# Altium project DD2088PoE_Daisy_Chain.PrjPcb (part 5 of 8)

## Sheet DD2088PoE_Daisy_Chain_IMU.SchDoc: =project_title
size Tabloid; CompanyName: Luxonis Holding; DrawnBy: D Dunga; Organization: Luxonis Holding; Address1: 1925 Harmony Park Drive; Address2: Westminster, CO; Address3: 80234; Address4: United States; SheetNumber: 13; SheetTotal: 15
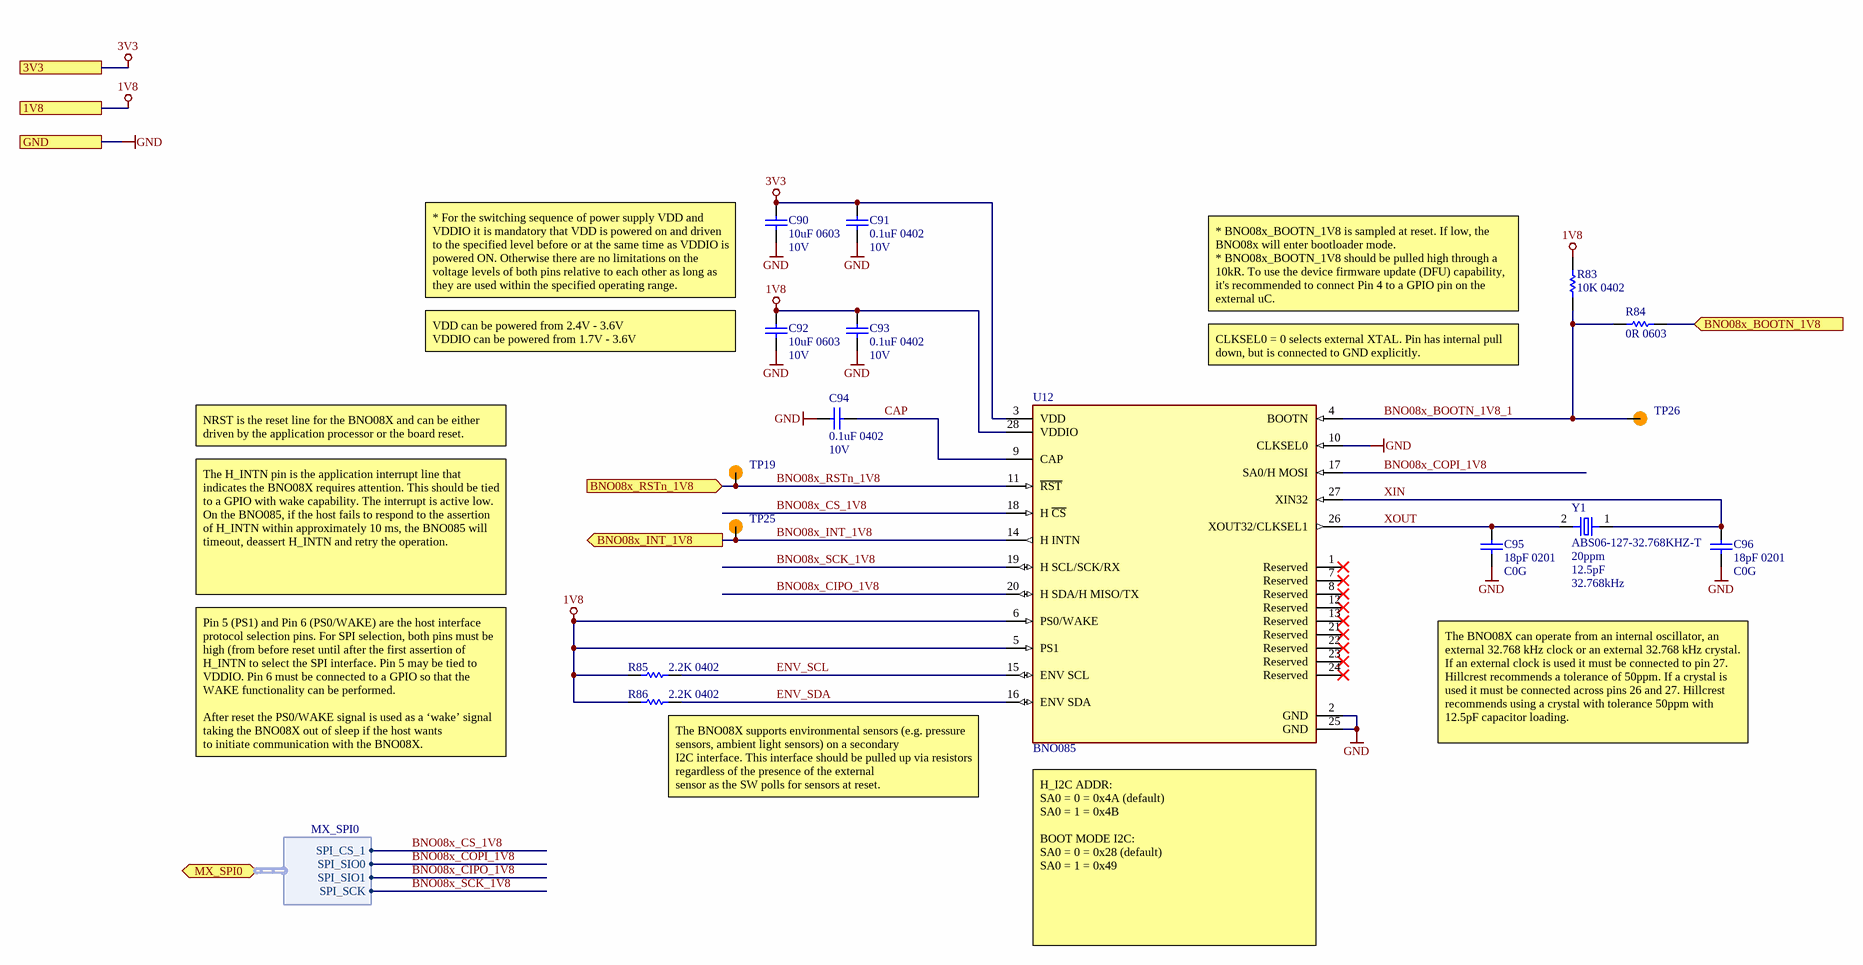
[diagram p9: DD2088PoE_Daisy_Chain_IMU.SchDoc]

### Parts
C90  10uF 0603  Voltage Rating: 10V  [CAPC0603(1608)100_L]
C91  0.1uF 0402  Voltage Rating: 10V  [CAPC0402(1005)70_L]
C92  10uF 0603  Voltage Rating: 10V  [CAPC0603(1608)100_L]
C93  0.1uF 0402  Voltage Rating: 10V  [CAPC0402(1005)70_L]
C94  0.1uF 0402  Voltage Rating: 10V  [CAPC0402(1005)70_L]
C95  18pF 0201  Dielectric: C0G  [CAPC0201(0603)33_L]
C96  18pF 0201  Dielectric: C0G  [CAPC0201(0603)33_L]
R83  10K 0402  [RESC0402(1005)_L]
R84  0R 0603  [RESC0603(1608)_L]
R85  2.2K 0402  [RESC0402(1005)_L]
R86  2.2K 0402  [RESC0402(1005)_L]
TP19  TP100_200_NS  [TP100_200_NS]  (value not drawn)  (no BOM)
TP25  TP100_200_NS  [TP100_200_NS]  (value not drawn)  (no BOM)
TP26  TP100_200_NS  [TP100_200_NS]  (value not drawn)  (no BOM)
U12  BNO085  [BNO085]
Y1  ABS06-127-32.768KHZ-T  Frequency Tolerance: 20ppm  Load Capacitance: 12.5pF  Frequency: 32.768kHz  [ABS06-127-32.768KHZ-T]

### Ports
1V8, 3V3, BNO08x_BOOTN_1V8 (in), BNO08x_INT_1V8 (out), BNO08x_RSTn_1V8 (in), GND, MX_SPI0 (bidir, harness MX_SPI0)

### Harnesses
MX_SPI0: SPI_SIO0, SPI_SIO1, SPI_CS_1, SPI_SCK

### Nets
1V8: C92.2 C93.2 R83.2 R85.1 R86.1 U12.5(PS1) U12.6(PS0/WAKE) U12.28(VDDIO) ; port 1V8
3V3: C90.2 C91.2 U12.3(VDD) ; port 3V3
GND: C90.1 C91.1 C92.1 C93.1 C94.2 C95.1 C96.1 U12.2(GND) U12.10(CLKSEL0) U12.25(GND) ; port GND
BNO08x_BOOTN_1V8: R84.2 ; port BNO08x_BOOTN_1V8
BNO08x_BOOTN_1V8_1: R83.1 R84.1 TP26.1 U12.4(BOOTN)
BNO08x_CIPO_1V8: U12.20(H_SDA/H_MISO/TX) ; port MX_SPI0.SPI_SIO1
BNO08x_COPI_1V8: U12.17(SA0/H_MOSI) ; port MX_SPI0.SPI_SIO0
BNO08x_CS_1V8: U12.18(H_~{CS}) ; port MX_SPI0.SPI_CS_1
BNO08x_INT_1V8: TP25.1 U12.14(H_INTN) ; port BNO08x_INT_1V8
BNO08x_RSTn_1V8: TP19.1 U12.11(~{RST}) ; port BNO08x_RSTn_1V8
BNO08x_SCK_1V8: U12.19(H_SCL/SCK/RX) ; port MX_SPI0.SPI_SCK
CAP: C94.1 U12.9(CAP)
ENV_SCL: R85.2 U12.15(ENV_SCL)
ENV_SDA: R86.2 U12.16(ENV_SDA)
XIN: C96.2 U12.27(XIN32) Y1.1
XOUT: C95.2 U12.26(XOUT32/CLKSEL1) Y1.2

Not connected (* = marked no-connect by the designer): U12 1(Reserved)* 7(Reserved)* 8(Reserved)* 12(Reserved)* 13(Reserved)* 21(Reserved)* 22(Reserved)* 23(Reserved)* 24(Reserved)*

### Notes on the sheet
- * For the switching sequence of power supply VDD and VDDIO it is mandatory that VDD is powered on and driven to the specified level before or at the same time as VDDIO is powered ON. Otherwise there are no limitations on the voltage levels of both pins relative to each other as long as they are used within the specified operating range.
- (near C92) VDD can be powered from 2.4V - 3.6V
  VDDIO can be powered from 1.7V - 3.6V
- * BNO08x_BOOTN_1V8 is sampled at reset. If low, the BNO08x will enter bootloader mode.
  * BNO08x_BOOTN_1V8 should be pulled high through a 10kR. To use the device firmware update (DFU) capability, it's recommended to connect Pin 4 to a GPIO pin on the external uC.
- CLKSEL0 = 0 selects external XTAL. Pin has internal pull down, but is connected to GND explicitly.
- NRST is the reset line for the BNO08X and can be either driven by the application processor or the board reset.
- The H_INTN pin is the application interrupt line that indicates the BNO08X requires attention. This should be tied to a GPIO with wake capability. The interrupt is active low. On the BNO085, if the host fails to respond to the assertion of H_INTN within approximately 10 ms, the BNO085 will timeout, deassert H_INTN and retry the operation.
- Pin 5 (PS1) and Pin 6 (PS0/WAKE) are the host interface protocol selection pins. For SPI selection, both pins must be high (from before reset until after the first assertion of H_INTN to select the SPI interface. Pin 5 may be tied to VDDIO. Pin 6 must be connected to a GPIO so that the WAKE functionality can be performed.
  After reset the PS0/WAKE signal is used as a ‘wake’ signal taking the BNO08X out of sleep if the host wants
  to initiate communication with the BNO08X.
- The BNO08X can operate from an internal oscillator, an external 32.768 kHz clock or an external 32.768 kHz crystal. If an external clock is used it must be connected to pin 27. Hillcrest recommends a tolerance of 50ppm. If a crystal is used it must be connected across pins 26 and 27. Hillcrest recommends using a crystal with tolerance 50ppm with 12.5pF capacitor loading.
- (near R86) The BNO08X supports environmental sensors (e.g. pressure sensors, ambient light sensors) on a secondary
  I2C interface. This interface should be pulled up via resistors regardless of the presence of the external
  sensor as the SW polls for sensors at reset.
- (near U12) H_I2C ADDR:
  SA0 = 0 = 0x4A (default)
  SA0 = 1 = 0x4B
  BOOT MODE I2C:
  SA0 = 0 = 0x28 (default)
  SA0 = 1 = 0x49
- Title
- Size:
- Date:
- Tabloid
- Number:
- Time:
- Revision:
- Sheet
- of
- Drawn by:

### Library data of the parts
C90 C92 = GRM188R61A106ME69D: CAP CER 10UF 10V X5R 0603 20%; Manufacturer 1: Murata; Material: Ceramic; Supplier 1: Digi-Key; Manufacturer Part Number 1: GRM188R61A106ME69D; Stock 1: 2873098; Pricing 1: 1=0.21000, 10=0.14100, 100=0.07130, 500=0.04876, 1000=0.04313 (USD); RoHS: Yes; Mount: Surface Mount; Case/Package: 0603; Weight: 0.000222oz; Case Code (Metric): 1608; Case Code (Imperial): 0603; Min Operating Temperature: -55°C; Max Operating Temperature: 85°C; Packaging: Tape and Reel; Tolerance: 20%; Capacitance: 10uF; Dielectric: X5R; Voltage Rating (DC): 10V; Package Quantity: 4000; Termination: SMD/SMT; Length: 1.6mm; Height: 0.8mm; Width: 0.8mm; Thickness: 0.035inch; Depth: 0.8mm; REACH SVHC: Unknown; Lead Free: Lead Free; ComponentLink1URL: http://www.mouser.com/ds/2/281/c02e-2905.pdf?src-supplier=Mouser; ComponentLink1Description: http://www.mouser.com/ds/2/281/c02e-2905.pdf?src-supplier=Mouser; ComponentLink2URL: http://components.arrow.com/part/dataview/0323_06119472?src-supplier=Arrow+Europe; ComponentLink2Description: http://components.arrow.com/part/dataview/0323_06119472?src-supplier=Arrow+Europe; ComponentLink3URL: http://www.farnell.com/datasheets/2048014.pdf?src-supplier=Farnell; ComponentLink3Description: http://www.farnell.com/datasheets/2048014.pdf?src-supplier=Farnell; ComponentLink4URL: http://www.farnell.com/datasheets/1872210.pdf?src-supplier=Farnell; ComponentLink4Description: http://www.farnell.com/datasheets/1872210.pdf?src-supplier=Farnell; ComponentLink5URL: http://search.murata.co.jp/Ceramy/image/img/A01X/G101/ENG/GRM188R61A106ME69-01.pdf?src-supplier=Digi-Key; ComponentLink5Description: http://search.murata.co.jp/Ceramy/image/img/A01X/G101/ENG/GRM188R61A106ME69-01.pdf?src-supplier=Digi-Key; ComponentLink6URL: http://www.farnell.com/datasheets/1872210.pdf?src-supplier=Newark; ComponentLink6Description: http://www.farnell.com/datasheets/1872210.pdf?src-supplier=Newark; ComponentLink7URL: http://www.farnell.com/datasheets/2048014.pdf?src-supplier=Element14; ComponentLink7Description: http://www.farnell.com/datasheets/2048014.pdf?src-supplier=Element14; ComponentLink8URL: http://www.farnell.com/datasheets/2048014.pdf?src-supplier=Newark; ComponentLink8Description: http://www.farnell.com/datasheets/2048014.pdf?src-supplier=Newark; Supplier Part Number 1: 490-10475-1-ND
C91 C93 C94 = GRM155R71A104JA01D: CAP CER 0.1UF 10V X7R 0402 5%; Manufacturer 1: Murata; Capacitance: 100nF; Supplier 1: Digi-Key; Manufacturer Part Number 1: GRM155R71A104JA01D; Stock 1: 1346709; Pricing 1: 1=0.10000, 10=0.02500, 100=0.01130, 500=0.00806, 1000=0.00633, 2500=0.00575, 5000=0.00529 (USD); RoHS: Yes; Mount: Surface Mount; Case/Package: 0402; Case Code (Imperial): 0402; Case Code (Metric): 1005; Min Operating Temperature: -55°C; Max Operating Temperature: 125°C; Tolerance: 5%; Packaging: Tape and Reel; Voltage Rating (DC): 10V; Dielectric: X7R; Package Quantity: 10000; Termination: SMD/SMT; Length: 1mm; Height: 0.5mm; Width: 0.02inch; Thickness: 0.022inch; Depth: 0.5mm; Radiation Hardening: No; Lead Free: Lead Free; ComponentLink1URL: https://datasheet.ciiva.com/5411/product-5411135.pdf?src-supplier=Mouser; ComponentLink1Description: https://datasheet.ciiva.com/5411/product-5411135.pdf?src-supplier=Mouser; ComponentLink2URL: https://datasheet.ciiva.com/11618/c02e-11618821.pdf?src-supplier=Avnet; ComponentLink2Description: https://datasheet.ciiva.com/11618/c02e-11618821.pdf?src-supplier=Avnet; Supplier Part Number 1: 490-10777-1-ND
C95 C96 = GRM0335C1E180FA01D: Cap Ceramic 18pF 25V C0G 1% Pad SMD 0201 125C T/R; Manufacturer 1: Murata; Supplier 1: Digi-Key; Manufacturer Part Number 1: GRM0335C1E180FA01D; RoHS: Yes; Category: Ceramic Capacitors; Stock 1: 27511; Pricing 1: 1=0.10000, 10=0.02100, 100=0.00930, 500=0.00666, 1000=0.00523, 2500=0.00476, 5000=0.00438 (USD); Mount: Surface Mount; Case/Package: 0201; Case Code (Imperial): 0201; Case Code (Metric): 0603; Min Operating Temperature: -55°C; Max Operating Temperature: 125°C; Capacitance: 18pF; Tolerance: 1%; Packaging: Tape and Reel; Voltage Rating (DC): 25V; Package Quantity: 15000; Voltage Rating: 25V; Termination: SMD/SMT; Length: 0.024inch; Height: 0.3mm; Thickness: 0.013inch; Width: 0.3mm; ComponentLink1URL: https://datasheet.ciiva.com/29538/partnumbering-e-01-29538328.pdf?src-supplier=Digi-Key; ComponentLink1Description: https://datasheet.ciiva.com/29538/partnumbering-e-01-29538328.pdf?src-supplier=Digi-Key; Supplier 2: Digi-Key; Supplier 3: Mouser; Supplier Part Number 3: 81-GRM0335C1E180FA1D; Supplier Part Number 2: 490-17804-2-ND; Supplier Part Number 1: 490-17804-1-ND
R83 = RC0402FR-1310KL: RES SMD 10K OHM 1% 0402 1/16W Chip Resistor, 0402 [1005 Metric], 10 kohm, RC Series, 50 V, Thick Film, 62.5 mW; Manufacturer 1: Yageo; Resistance: 10kR; Temperature Coefficient: 100ppm/°C; Power Rating: 62.5mW; Voltage Rating: 50V; ComponentLink1URL: https://datasheet.ciiva.com/16940/pyu-rc0402-51-rohs-l-6-16940293.pdf?src-supplier=Avnet+Europe; ComponentLink1Description: https://datasheet.ciiva.com/16940/pyu-rc0402-51-rohs-l-6-16940293.pdf?src-supplier=Avnet+Europe; ComponentLink2URL: https://datasheet.ciiva.com/28386/pyu-rc0402-51-rohs-l-6-28386855.pdf?src-supplier=Avnet+Europe; ComponentLink2Description: https://datasheet.ciiva.com/28386/pyu-rc0402-51-rohs-l-6-28386855.pdf?src-supplier=Avnet+Europe; ComponentLink3URL: https://datasheet.ciiva.com/16740/pyu-rc0402-51-rohs-l-6-r-16740602.pdf?src-supplier=Future+Electronics; ComponentLink3Description: https://datasheet.ciiva.com/16740/pyu-rc0402-51-rohs-l-6-r-16740602.pdf?src-supplier=Future+Electronics; ComponentLink4URL: https://datasheet.ciiva.com/8891/pyu-rc0402-51-rohs-l-6-8891339.pdf?src-supplier=Avnet; ComponentLink4Description: https://datasheet.ciiva.com/8891/pyu-rc0402-51-rohs-l-6-8891339.pdf?src-supplier=Avnet; ComponentLink5URL: https://datasheet.ciiva.com/5557/pyu-rc0402-51-rohs-l-6-r-5557997.pdf?src-supplier=Mouser; ComponentLink5Description: https://datasheet.ciiva.com/5557/pyu-rc0402-51-rohs-l-6-r-5557997.pdf?src-supplier=Mouser; ComponentLink6URL: https://datasheet.ciiva.com/7983/1018594-7983533.pdf?src-supplier=Element14; ComponentLink6Description: https://datasheet.ciiva.com/7983/1018594-7983533.pdf?src-supplier=Element14; Supplier 1: Newark; Manufacturer Part Number 1: RC0402FR-1310KL; Stock 1: 62239; Pricing 1: 1=0.10000, 25=0.01200, 100=0.00400, 250=0.00400, 500=0.00300, 1000=0.00300 (USD); RoHS: Yes; Case/Package: 0402; Number of Pins: 2; Contact Plating: Tin,Matte,Lead; Case Code (Imperial): 0402; Case Code (Metric): 1005; Min Operating Temperature: -55°C; Max Operating Temperature: 155°C; Tolerance: 1%; Composition: Thick Film; Packaging: Tape and Reel; Termination: SMD/SMT; Military Standard: Not; Voltage Rating (DC): 50V; Working Voltage: 50V; Number of Terminations: 2; Length: 1mm; Depth: 0.5mm; Radiation Hardening: No; REACH SVHC: No SVHC; Lead Free: Lead Free; Supplier Part Number 1: 67R9960; Supplier 2: Future Electronics; Supplier 3: Mouser; Supplier 4: Element14; Supplier Part Number 2: RC0402FR-1310KL-CUTT; Supplier Part Number 3: 603-RC0402FR-1310KL; Supplier Part Number 4: 1799235
R84 = CRCW06030000Z0EA: RES SMD 0 OHM JUMPER 1/10W 0603 0 Ohms Jumper 0.1W, 1/10W Chip Resistor 0603 (1608 Metric) Automotive AEC-Q200 Thick Film; Manufacturer 1: Vishay; Manufacturer Part Number 1: CRCW0603-0000Z0EA; Resistance: 0mR; Power Rating: 100mW; Voltage Rating: 75V; Temperature Coefficient: 100ppm/°C; Tolerance: 5%; Current Rating: 2A; Supplier 1: Digi-Key; Stock 1: 742743; Pricing 1: 1=0.100000, 10=0.034000, 25=0.024400, 50=0.018600, 100=0.013800, 250=0.010480, 500=0.008400, 1000=0.006180 (USD); RoHS: Yes; Mount: Surface Mount; Case/Package: 0603; Weight: 7.1E-05oz; Contact Plating: Tin,Lead; Case Code (Metric): 1608; Case Code (Imperial): 0603; Min Operating Temperature: -55°C; Max Operating Temperature: 155°C; Composition: Thick Film; Termination: SMD/SMT; Packaging: Tape and Reel; Package Quantity: 1; Number of Terminations: 2; Military Standard: Not; Max Power Dissipation: 100mW; Voltage Rating (DC): 75V; Features: Automotive AEC-Q200; Working Voltage: 75V; Length: 1.55mm; Height: 0.02inch; Width: 0.033inch; Depth: 0.85mm; Radiation Hardening: No; Lead Free: Lead Free; REACH SVHC: Unknown; ComponentLink1URL: https://datasheet.ciiva.com/2461/dcrcwe3-2461968.pdf?src-supplier=Digi-Key; ComponentLink1Description: https://datasheet.ciiva.com/2461/dcrcwe3-2461968.pdf?src-supplier=Digi-Key; ComponentLink2URL: https://datasheet.ciiva.com/2461/dcrcwe3-2461969.pdf?src-supplier=Digi-Key; ComponentLink2Description: https://datasheet.ciiva.com/2461/dcrcwe3-2461969.pdf?src-supplier=Digi-Key; ComponentLink3URL: https://datasheet.ciiva.com/2461/dcrcwe3-2461970.pdf?src-supplier=Digi-Key; ComponentLink3Description: https://datasheet.ciiva.com/2461/dcrcwe3-2461970.pdf?src-supplier=Digi-Key; ComponentLink4URL: https://datasheet.ciiva.com/8340/dcrcwe3-8340197.pdf?src-supplier=Avnet; ComponentLink4Description: https://datasheet.ciiva.com/8340/dcrcwe3-8340197.pdf?src-supplier=Avnet; ComponentLink5URL: https://datasheet.ciiva.com/16941/dcrcw-16941302.pdf?src-supplier=Avnet+Europe; ComponentLink5Description: https://datasheet.ciiva.com/16941/dcrcw-16941302.pdf?src-supplier=Avnet+Europe; ComponentLink6URL: https://datasheet.ciiva.com/16199/dcrcwe3-16199063.pdf?src-supplier=Future+Electronics; ComponentLink6Description: https://datasheet.ciiva.com/16199/dcrcwe3-16199063.pdf?src-supplier=Future+Electronics; ComponentLink7URL: https://datasheet.ciiva.com/16725/70201119-16725175.pdf?src-supplier=Allied+Electronics; ComponentLink7Description: https://datasheet.ciiva.com/16725/70201119-16725175.pdf?src-supplier=Allied+Electronics; ComponentLink8URL: https://datasheet.ciiva.com/26316/fld-crcw-e3-data-en-26316615.pdf?src-supplier=Distrelec; ComponentLink8Description: https://datasheet.ciiva.com/26316/fld-crcw-e3-data-en-26316615.pdf?src-supplier=Distrelec; ComponentLink9URL: https://datasheet.ciiva.com/5544/dcrcwe3-109170-5544344.pdf?src-supplier=Mouser; ComponentLink9Description: https://datasheet.ciiva.com/5544/dcrcwe3-109170-5544344.pdf?src-supplier=Mouser; ComponentLink10URL: https://datasheet.ciiva.com/7841/1720486-7841816.pdf?src-supplier=Element14; ComponentLink10Description: https://datasheet.ciiva.com/7841/1720486-7841816.pdf?src-supplier=Element14; ComponentLink11URL: https://datasheet.ciiva.com/7841/1720486-7841817.pdf?src-supplier=Element14; ComponentLink11Description: https://datasheet.ciiva.com/7841/1720486-7841817.pdf?src-supplier=Element14; ComponentLink12URL: https://datasheet.ciiva.com/7841/125364-7841818.pdf?src-supplier=Element14; ComponentLink12Description: https://datasheet.ciiva.com/7841/125364-7841818.pdf?src-supplier=Element14; ComponentLink13URL: https://datasheet.ciiva.com/16721/70201119-16721450.pdf?src-supplier=Allied+Electronics; ComponentLink13Description: https://datasheet.ciiva.com/16721/70201119-16721450.pdf?src-supplier=Allied+Electronics; Supplier Part Number 1: 541-0.0GCT-ND
R85 R86 = RC0402FR-072K2L: RES SMD 2.2K OHM 1% 1/16W 0402; Manufacturer 1: Yageo; Resistance: 2.2kR; Temperature Coefficient: 100ppm/°C; Power Rating: 63mW; Voltage Rating: 50V; Supplier 1: Digi-Key; Manufacturer Part Number 1: RC0402FR-072K2L; Stock 1: 12579098; Pricing 1: 1=0.10000, 10=0.01600, 100=0.00640, 1000=0.00289, 2500=0.00251, 5000=0.00207 (USD); RoHS: Yes; Case/Package: 0402; Weight: 2.3E-05oz; Case Code (Imperial): 0402; Case Code (Metric): 1005; Min Operating Temperature: -55°C; Max Operating Temperature: 155°C; Packaging: Tape and Reel; Tolerance: 1%; Composition: Thick Film; Termination: SMD/SMT; Military Standard: Not; Length: 1mm; Height: 0.35mm; Width: 0.5mm; Depth: 0.5mm; Lead Free: Lead Free; REACH SVHC: Unknown; ComponentLink1URL: https://datasheet.ciiva.com/11808/0900766b80c66297-11808786.pdf?src-supplier=RSComponents; ComponentLink1Description: https://datasheet.ciiva.com/11808/0900766b80c66297-11808786.pdf?src-supplier=RSComponents; ComponentLink2URL: https://datasheet.ciiva.com/12577/pyu-rc0402-51-rohs-l-6-r-12577429.pdf?src-supplier=Mouser; ComponentLink2Description: https://datasheet.ciiva.com/12577/pyu-rc0402-51-rohs-l-6-r-12577429.pdf?src-supplier=Mouser; ComponentLink3URL: https://datasheet.ciiva.com/16741/pyu-rc0402-51-rohs-l-6-r-16741015.pdf?src-supplier=Future+Electronics; ComponentLink3Description: https://datasheet.ciiva.com/16741/pyu-rc0402-51-rohs-l-6-r-16741015.pdf?src-supplier=Future+Electronics; ComponentLink4URL: https://datasheet.ciiva.com/7983/1018594-7983515.pdf?src-supplier=Element14; ComponentLink4Description: https://datasheet.ciiva.com/7983/1018594-7983515.pdf?src-supplier=Element14; ComponentLink5URL: https://datasheet.ciiva.com/46383/1018594-46383563.pdf?src-supplier=Element14; ComponentLink5Description: https://datasheet.ciiva.com/46383/1018594-46383563.pdf?src-supplier=Element14; ComponentLink6URL: https://datasheet.ciiva.com/7849/1018594-7849928.pdf?src-supplier=Element14; ComponentLink6Description: https://datasheet.ciiva.com/7849/1018594-7849928.pdf?src-supplier=Element14; ComponentLink7URL: https://datasheet.ciiva.com/7849/1018594-7849929.pdf?src-supplier=Element14; ComponentLink7Description: https://datasheet.ciiva.com/7849/1018594-7849929.pdf?src-supplier=Element14; Supplier 2: Mouser; Supplier 3: Newark; Supplier Part Number 1: 311-2.20KLRCT-ND; Supplier Part Number 2: 603-RC0402FR-072K2L; Supplier Part Number 3: 98K7523
TP19 TP25 TP26 = TEST_POINT
U12 = BNO085: IMU ACCEL/GYRO/MAG I2C 32BIT; Manufacturer 1: Hillcrest Laboratories; Sensor Type: Accelerometer,Gyroscope,Magnetometer; Output Type: SPI,I2C; Supplier 1: Digi-Key; Manufacturer Part Number 1: BNO085; RoHS: No; Category: Inertial Measurement Units (IMUs); Stock 1: 11593; Pricing 1: 1=11.85000, 5=10.31200, 10=9.28100, 25=8.25000, 50=7.63120, 100=6.60000, 500=6.18750, 1000=5.77500 (USD); Mount: Surface Mount; Case/Package: LGA; Min Operating Temperature: -40°C; Max Operating Temperature: 85°C; Packaging: Tape and Reel; ComponentLink1URL: https://www.hillcrestlabs.com/downloads/bno080-datasheet?src-supplier=Digi-Key; ComponentLink1Description: https://www.hillcrestlabs.com/downloads/bno080-datasheet?src-supplier=Digi-Key; ComponentLink2URL: https://www.hillcrestlabs.com/downloads/bno080-migration-guide?src-supplier=Digi-Key; ComponentLink2Description: https://www.hillcrestlabs.com/downloads/bno080-migration-guide?src-supplier=Digi-Key; Supplier Part Number 1: 1888-1006-1-ND
Y1 = ABS06-127-32.768KHZ-T: CRYSTAL 32.768kHz ±20ppm Crystal 12.5pF 90 kOhms 2-SMD, No Lead; Manufacturer 1: Abracon; ESR (Equivalent Series Resistance): 90kR; Supplier 1: Digi-Key; Manufacturer Part Number 1: ABS06-127-32.768KHZ-T; RoHS: Yes; Stock 1: 1640; Pricing 1: 1=0.69000, 10=0.60700, 50=0.56760, 100=0.50160, 500=0.47520, 1000=0.39600 (USD); Mount: Surface Mount; Case/Package: SMD/SMT; Min Operating Temperature: -40°C; Max Operating Temperature: 85°C; Packaging: Tape and Reel; ComponentLink1URL: http://www.farnell.com/datasheets/2614114.pdf?src-supplier=Farnell; ComponentLink1Description: http://www.farnell.com/datasheets/2614114.pdf?src-supplier=Farnell; ComponentLink2URL: https://abracon.com/datasheets/ABS06-127-32.768kHz-T.pdf?src-supplier=Digi-Key; ComponentLink2Description: https://abracon.com/datasheets/ABS06-127-32.768kHz-T.pdf?src-supplier=Digi-Key; ComponentLink3URL: http://www.farnell.com/datasheets/2614114.pdf?src-supplier=Newark; ComponentLink3Description: http://www.farnell.com/datasheets/2614114.pdf?src-supplier=Newark; Supplier 2: Digi-Key; Supplier 3: Mouser; Supplier 4: Verical; Supplier Part Number 1: 535-14513-1-ND; Supplier Part Number 2: 535-14513-6-ND; Supplier Part Number 3: 815-ABS0612732.768KT; Supplier Part Number 4: ABS06-127-32.768KHZ-T

## Sheet RJ45_1.SchDoc: =project_title
size Tabloid; CompanyName: Luxonis Holding; DrawnBy: D Dunga; Organization: Luxonis Holding; Address1: 1925 Harmony Park Drive; Address2: Westminster, CO; Address3: 80234; Address4: United States; SheetNumber: 9; SheetTotal: 15
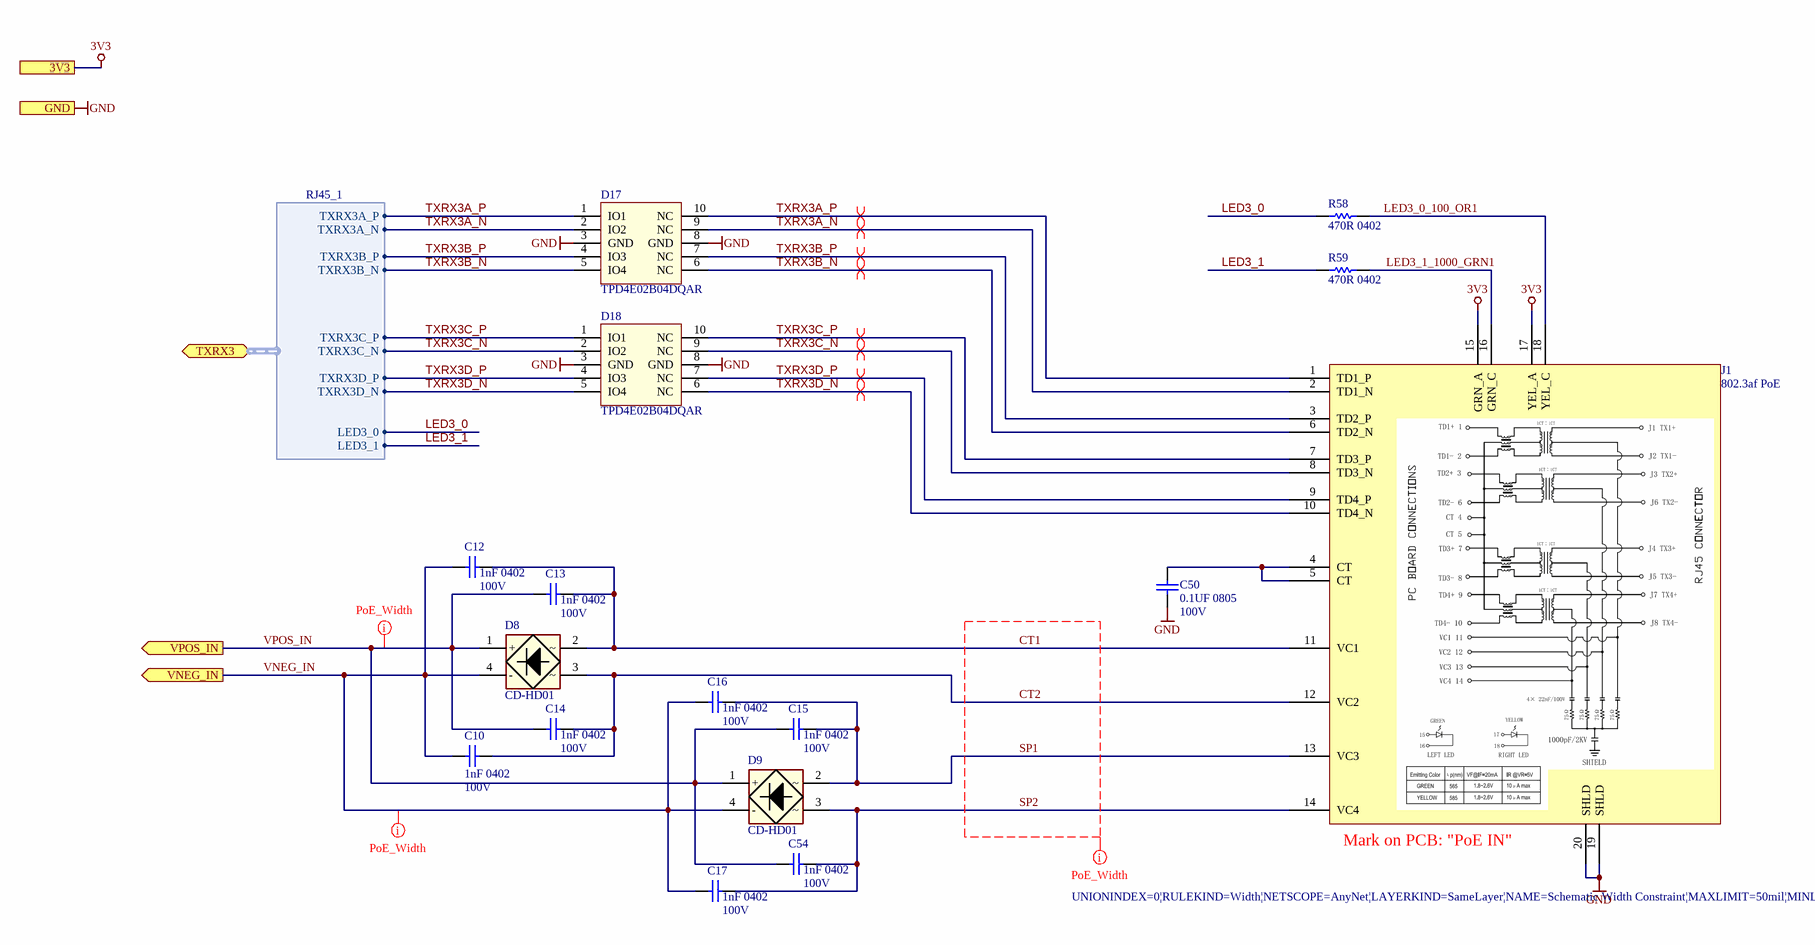
[diagram p10: RJ45_1.SchDoc]

### Parts
C10  1nF 0402  Voltage: 100V  [CAPC0402(1005)60_N]
C12  1nF 0402  Voltage: 100V  [CAPC0402(1005)60_N]
C13  1nF 0402  Voltage: 100V  [CAPC0402(1005)60_N]
C14  1nF 0402  Voltage: 100V  [CAPC0402(1005)60_N]
C15  1nF 0402  Voltage: 100V  [CAPC0402(1005)60_N]
C16  1nF 0402  Voltage: 100V  [CAPC0402(1005)60_N]
C17  1nF 0402  Voltage: 100V  [CAPC0402(1005)60_N]
C50  0.1UF 0805  Voltage Rating: 100V  [CAPC0805(2012)145_N]
C54  1nF 0402  Voltage: 100V  [CAPC0402(1005)60_N]
D8  CD-HD01  [SMD-4]
D9  CD-HD01  [SMD-4]
D17  TPD4E02B04DQAR  [TPD4E02B04DQAR]
D18  TPD4E02B04DQAR  [TPD4E02B04DQAR]
J1  802.3af PoE  [TRJG0926HENL]
R58  470R 0402  [RESC0402(1005)_N]
R59  470R 0402  [RESC0402(1005)_N]

### Ports
3V3, GND, TXRX3 (bidir, harness RJ45_1), VNEG_IN (out), VPOS_IN (out)

### Harnesses
RJ45_1: TXRX3A_P, TXRX3A_N, TXRX3B_P, TXRX3B_N, TXRX3C_P, TXRX3C_N, TXRX3D_P, TXRX3D_N, LED3_0, LED3_1

### Nets
3V3: J1.15(GRN_A) J1.17(YEL_A) ; port 3V3
GND: C50.1 D17.3(GND) D17.8(GND) D18.3(GND) D18.8(GND) J1.19(SHLD) J1.20(SHLD) ; port GND
VNEG_IN: C10.2 C12.2 C16.2 C17.2 D8.4(-) D9.4(-) ; port VNEG_IN
CT1: C12.1 C13.1 D8.2 J1.11(VC1)
CT2: C10.1 C14.1 D8.3 J1.12(VC2)
LED3_0: R58.1 ; port TXRX3.LED3_0
LED3_0_100_OR1: J1.18(YEL_C) R58.2
LED3_1: R59.1 ; port TXRX3.LED3_1
LED3_1_1000_GRN1: J1.16(GRN_C) R59.2
SP1: C15.1 C16.1 D9.2 J1.13(VC3)
SP2: C17.1 C54.1 D9.3 J1.14(VC4)
TXRX3A_N: D17.2(IO2) D17.9(NC) J1.2(TD1_N) ; port TXRX3.TXRX3A_N
TXRX3A_P: D17.1(IO1) D17.10(NC) J1.1(TD1_P) ; port TXRX3.TXRX3A_P
TXRX3B_N: D17.5(IO4) D17.6(NC) J1.6(TD2_N) ; port TXRX3.TXRX3B_N
TXRX3B_P: D17.4(IO3) D17.7(NC) J1.3(TD2_P) ; port TXRX3.TXRX3B_P
TXRX3C_N: D18.2(IO2) D18.9(NC) J1.8(TD3_N) ; port TXRX3.TXRX3C_N
TXRX3C_P: D18.1(IO1) D18.10(NC) J1.7(TD3_P) ; port TXRX3.TXRX3C_P
TXRX3D_N: D18.5(IO4) D18.6(NC) J1.10(TD4_N) ; port TXRX3.TXRX3D_N
TXRX3D_P: D18.4(IO3) D18.7(NC) J1.9(TD4_P) ; port TXRX3.TXRX3D_P
VPOS_IN: C13.2 C14.2 C15.2 C54.2 D8.1(+) D9.1(+) ; port VPOS_IN
NetC50_2: C50.2 J1.4(CT) J1.5(CT)

### Layout directives
rule Width Constraint [Pref Width = 15mil    Min Width = 4mil    Max Width = 50mil]; net class PoE: CT1, CT2, SP1, SP2, VNEG_IN, VPOS_IN
differential pair; net class ETH; differential pair class 100ohm: TXRX3A_N, TXRX3A_P, TXRX3B_N, TXRX3B_P, TXRX3C_N, TXRX3C_P, TXRX3D_N, TXRX3D_P

### Notes on the sheet
- (near J1) Mark on PCB: "PoE IN"
- Title
- Size:
- Date:
- Tabloid
- Number:
- Time:
- Revision:
- Sheet
- of
- Drawn by:

### Library data of the parts
C10 C12-C17 C54 = GRM155R72A102KA01D: CAP CER 1000PF 100V X7R 0402; Manufacturer 1: Murata; Material: Ceramic; Tolerance: 10%; Supplier 1: Digi-Key; Manufacturer Part Number 1: GRM155R72A102KA01D; Stock 1: 634387; Pricing 1: 1=0.10000, 10=0.05700, 100=0.02530, 500=0.01810, 1000=0.01422, 2500=0.01292, 5000=0.01189 (USD); RoHS: Yes; Mount: Surface Mount; Case/Package: 0402; Case Code (Metric): 1005; Case Code (Imperial): 0402; Min Operating Temperature: -55°C; Max Operating Temperature: 125°C; Capacitance: 1nF; Packaging: Tape and Reel; Voltage Rating (DC): 100V; Dielectric: X7R; Package Quantity: 10000; Termination: SMD/SMT; Voltage Rating: 100V; Length: 1mm; Height: 0.5mm; Depth: 0.5mm; Width: 0.5mm; Thickness: 0.022inch; Radiation Hardening: No; REACH SVHC: No SVHC; Lead Free: Lead Free; ComponentLink1URL: https://datasheet.ciiva.com/18184/getdatasheetpartid-223878-18184773.pdf?src-supplier=Verical; ComponentLink1Description: https://datasheet.ciiva.com/18184/getdatasheetpartid-223878-18184773.pdf?src-supplier=Verical; ComponentLink2URL: https://datasheet.ciiva.com/11621/product-11621687.pdf?src-supplier=Avnet; ComponentLink2Description: https://datasheet.ciiva.com/11621/product-11621687.pdf?src-supplier=Avnet; ComponentLink3URL: https://datasheet.ciiva.com/6270/partnumbering-e-01-6270792.pdf?src-supplier=Digi-Key; ComponentLink3Description: https://datasheet.ciiva.com/6270/partnumbering-e-01-6270792.pdf?src-supplier=Digi-Key; ComponentLink4URL: https://datasheet.ciiva.com/6270/partnumbering-e-01-6270796.pdf?src-supplier=Digi-Key; ComponentLink4Description: https://datasheet.ciiva.com/6270/partnumbering-e-01-6270796.pdf?src-supplier=Digi-Key; ComponentLink5URL: https://datasheet.ciiva.com/6270/partnumbering-e-01-6270798.pdf?src-supplier=Digi-Key; ComponentLink5Description: https://datasheet.ciiva.com/6270/partnumbering-e-01-6270798.pdf?src-supplier=Digi-Key; Supplier 2: Mouser; Supplier 3: Arrow; Supplier Part Number 1: 490-6366-1-ND; Supplier Part Number 2: 81-GRM155R72A102KA1D; Supplier Part Number 3: GRM155R72A102KA01D
C50 = CL21B104KCFNNNE: CAP CER 0.1UF 100V X7R 0805; Manufacturer 1: Samsung; Tolerance: 10%; Capacitance: 100nF; Supplier 1: Digi-Key; Manufacturer Part Number 1: CL21B104KCFNNNE; Stock 1: 93036; Pricing 1: 1=0.10000, 10=0.06800, 100=0.03050, 500=0.02180, 1000=0.01712 (USD); RoHS: Yes; Mount: Surface Mount; Case/Package: 0805; Case Code (Metric): 2012; Case Code (Imperial): 0805; Min Operating Temperature: -55°C; Max Operating Temperature: 125°C; Packaging: Tape and Reel; Dielectric: X7R; Length: 2mm; Width: 0.049inch; Thickness: 0.053inch; Depth: 1.25mm; Radiation Hardening: No; ComponentLink1URL: https://datasheet.ciiva.com/26936/getdatasheetpartid-781823-26936904.pdf?src-supplier=Verical; ComponentLink1Description: https://datasheet.ciiva.com/26936/getdatasheetpartid-781823-26936904.pdf?src-supplier=Verical; Supplier 2: Newark; Supplier 3: Future Electronics; Supplier Part Number 3: CL21B104KCFNNNE-CUTT; Supplier Part Number 2: 82AC9430; Supplier Part Number 1: 1276-6840-1-ND
D8 D9 = CD-HD01: CD-HD0x Series Schottky Bridge Rectifier Diode 100V 4-Pin Surface Mount T/R; Manufacturer 1: Bourns; Average Rectified Current: 1A; Mount: Surface Mount; Min Operating Temperature: -55°C; Max Operating Temperature: 125°C; Packaging: Tape and Reel; RoHS Compliant: Yes; ComponentLink1URL: http://www.farnell.com/datasheets/2176057.pdf?src-supplier=Farnell; ComponentLink1Description: http://www.farnell.com/datasheets/2176057.pdf?src-supplier=Farnell; ComponentLink2URL: https://www.bourns.com/docs/Product-Datasheets/cd-hd0x.pdf?src-supplier=Digi-Key; ComponentLink2Description: https://www.bourns.com/docs/Product-Datasheets/cd-hd0x.pdf?src-supplier=Digi-Key; Supplier 1: Digi-Key; Supplier Part Number 1: CD-HD01CT-ND; Manufacturer Part Number 1: CD-HD01; RoHS: Yes; Stock 1: 5000; Pricing 1: 1=0.67000, 10=0.57800, 100=0.43120, 500=0.33880, 1000=0.26180, 2000=0.23870 (USD); Supplier 2: Mouser; Supplier Part Number 2: 652-CD-HD01
D17 D18 = TPD4E02B04DQAR: TVS DIODE 3.6V 8.8V 10USON 8.8V (Typ) Clamp 5A (8/20µs) Ipp Tvs Diode Surface Mount 10-USON (2.5x1); Manufacturer 1: Texas Instruments; Number of Bidirectional Channels: 4; Min Breakdown Voltage: 5.5V; Peak Pulse Power: 17W; Power Line Protection: No; Interface: USB,HDMI; Supplier 1: Digi-Key; Manufacturer Part Number 1: TPD4E02B04DQAR; Stock 1: 25615; Pricing 1: 1=0.69000, 10=0.60800, 100=0.46650, 500=0.36874, 1000=0.29499 (USD); RoHS: Yes; Mount: Surface Mount; Number of Pins: 10; Min Operating Temperature: -40°C; Max Operating Temperature: 125°C; Packaging: Cut Tape; Reverse Standoff Voltage: 3.6V; Clamping Voltage: 8.8V; Operating Supply Voltage: 3.6V; Peak Pulse Current: 5A; Number of Channels: 4; Composition: Zener; REACH SVHC: No SVHC; Lead Free: Lead Free; ComponentLink1URL: http://www.ti.com/general/docs/lit/getliterature.tsp?genericPartNumber=TPD4E02B04&amp;&amp;fileType=pdf&src-supplier=Element14; ComponentLink1Description: http://www.ti.com/general/docs/lit/getliterature.tsp?genericPartNumber=TPD4E02B04&amp;&amp;fileType=pdf&src-supplier=Element14; ComponentLink2URL: http://www.ti.com/lit/ds/symlink/tpd4e02b04.pdf?src-supplier=Farnell; ComponentLink2Description: http://www.ti.com/lit/ds/symlink/tpd4e02b04.pdf?src-supplier=Farnell; ComponentLink3URL: http://www.ti.com/lit/ds/symlink/tpd4e02b04.pdf?src-supplier=Newark; ComponentLink3Description: http://www.ti.com/lit/ds/symlink/tpd4e02b04.pdf?src-supplier=Newark; ComponentLink4URL: http://www.ti.com/lit/ds/symlink/tpd4e02b04.pdf?src-supplier=Digi-Key; ComponentLink4Description: http://www.ti.com/lit/ds/symlink/tpd4e02b04.pdf?src-supplier=Digi-Key; Supplier Part Number 1: 296-43875-1-ND
J1 = TRJG0926HENL: CONN MAGJACK 1PORT 1000 BASET; Manufacturer 1: Trxcom; System: Connector; Manufacturer Part Number 1: TRJG0926HENL; Supplier 1: Trxcom; Supplier Part Number 1: TRJG0926HENL
R58 R59 = CRCW0402470RFKED: RES SMD 470 OHM 1% 1/16W 0402; Manufacturer 1: Vishay; Temperature Coefficient: 100ppm/°C; Power Rating: 63mW; Voltage Rating: 50V; Supplier 1: Digi-Key; Manufacturer Part Number 1: CRCW0402470RFKED; Stock 1: 9199; Pricing 1: 1=0.10000, 10=0.03800, 100=0.01540, 1000=0.00690, 2500=0.00599, 5000=0.00495 (USD); RoHS: Yes; Case/Package: 0402; Weight: 2.3E-05oz; Case Code (Imperial): 0402; Case Code (Metric): 1005; Min Operating Temperature: -55°C; Max Operating Temperature: 155°C; Packaging: Tape and Reel; Resistance: 470R; Tolerance: 1%; Composition: Thick Film; Voltage Rating (DC): 50V; Termination: SMD/SMT; Military Standard: Not; Length: 1mm; Height: 0.35mm; Width: 0.5mm; Depth: 0.5mm; Lead Free: Lead Free; ComponentLink1URL: https://datasheet.ciiva.com/11811/0900766b80d98824-11811416.pdf?src-supplier=RSComponents; ComponentLink1Description: https://datasheet.ciiva.com/11811/0900766b80d98824-11811416.pdf?src-supplier=RSComponents; Supplier 2: Newark; Supplier Part Number 1: 541-470LCT-ND; Supplier Part Number 2: 26W9133; Mount: Surface Mount; Contact Plating: Tin; Number of Terminations: 2; Package Quantity: 10; Max Power Dissipation: 63mW; Features: Automotive AEC-Q200; Radiation Hardening: No; REACH SVHC: Unknown; ComponentLink2URL: https://datasheet.ciiva.com/16764/70201119-16764886.pdf?src-supplier=Allied+Electronics; ComponentLink2Description: https://datasheet.ciiva.com/16764/70201119-16764886.pdf?src-supplier=Allied+Electronics; ComponentLink3URL: https://datasheet.ciiva.com/28613/1720486-28613479.pdf?src-supplier=Element14; ComponentLink3Description: https://datasheet.ciiva.com/28613/1720486-28613479.pdf?src-supplier=Element14; ComponentLink4URL: https://datasheet.ciiva.com/3256/dcrcwe3-3256553.pdf?src-supplier=Avnet; ComponentLink4Description: https://datasheet.ciiva.com/3256/dcrcwe3-3256553.pdf?src-supplier=Avnet; ComponentLink5URL: https://datasheet.ciiva.com/7777/1720486-7777243.pdf?src-supplier=Element14; ComponentLink5Description: https://datasheet.ciiva.com/7777/1720486-7777243.pdf?src-supplier=Element14; ComponentLink6URL: https://datasheet.ciiva.com/8336/dcrcwe3-8336715.pdf?src-supplier=Avnet; ComponentLink6Description: https://datasheet.ciiva.com/8336/dcrcwe3-8336715.pdf?src-supplier=Avnet; ComponentLink7URL: https://datasheet.ciiva.com/7777/1697337-7777244.pdf?src-supplier=Element14; ComponentLink7Description: https://datasheet.ciiva.com/7777/1697337-7777244.pdf?src-supplier=Element14; ComponentLink8URL: https://datasheet.ciiva.com/2463/dcrcwe3-2463085.pdf?src-supplier=Digi-Key; ComponentLink8Description: https://datasheet.ciiva.com/2463/dcrcwe3-2463085.pdf?src-supplier=Digi-Key; ComponentLink9URL: https://datasheet.ciiva.com/16362/dcrcwe3-16362109.pdf?src-supplier=Future+Electronics; ComponentLink9Description: https://datasheet.ciiva.com/16362/dcrcwe3-16362109.pdf?src-supplier=Future+Electronics; ComponentLink10URL: https://datasheet.ciiva.com/16882/dcrcwe3-16882493.pdf?src-supplier=Avnet+Europe; ComponentLink10Description: https://datasheet.ciiva.com/16882/dcrcwe3-16882493.pdf?src-supplier=Avnet+Europe; ComponentLink11URL: https://datasheet.ciiva.com/2463/dcrcwe3-2463086.pdf?src-supplier=Digi-Key; ComponentLink11Description: https://datasheet.ciiva.com/2463/dcrcwe3-2463086.pdf?src-supplier=Digi-Key; ComponentLink12URL: https://datasheet.ciiva.com/2463/dcrcwe3-2463087.pdf?src-supplier=Digi-Key; ComponentLink12Description: https://datasheet.ciiva.com/2463/dcrcwe3-2463087.pdf?src-supplier=Digi-Key

## Sheet RJ45_2.SchDoc: =project_title
size Tabloid; CompanyName: Luxonis Holding; DrawnBy: Dan Dunga; Organization: Luxonis Holding; Address1: 1925 Harmony Park Drive; Address2: Westminster, CO; Address3: 80234; Address4: United States; SheetNumber: 10; SheetTotal: 15
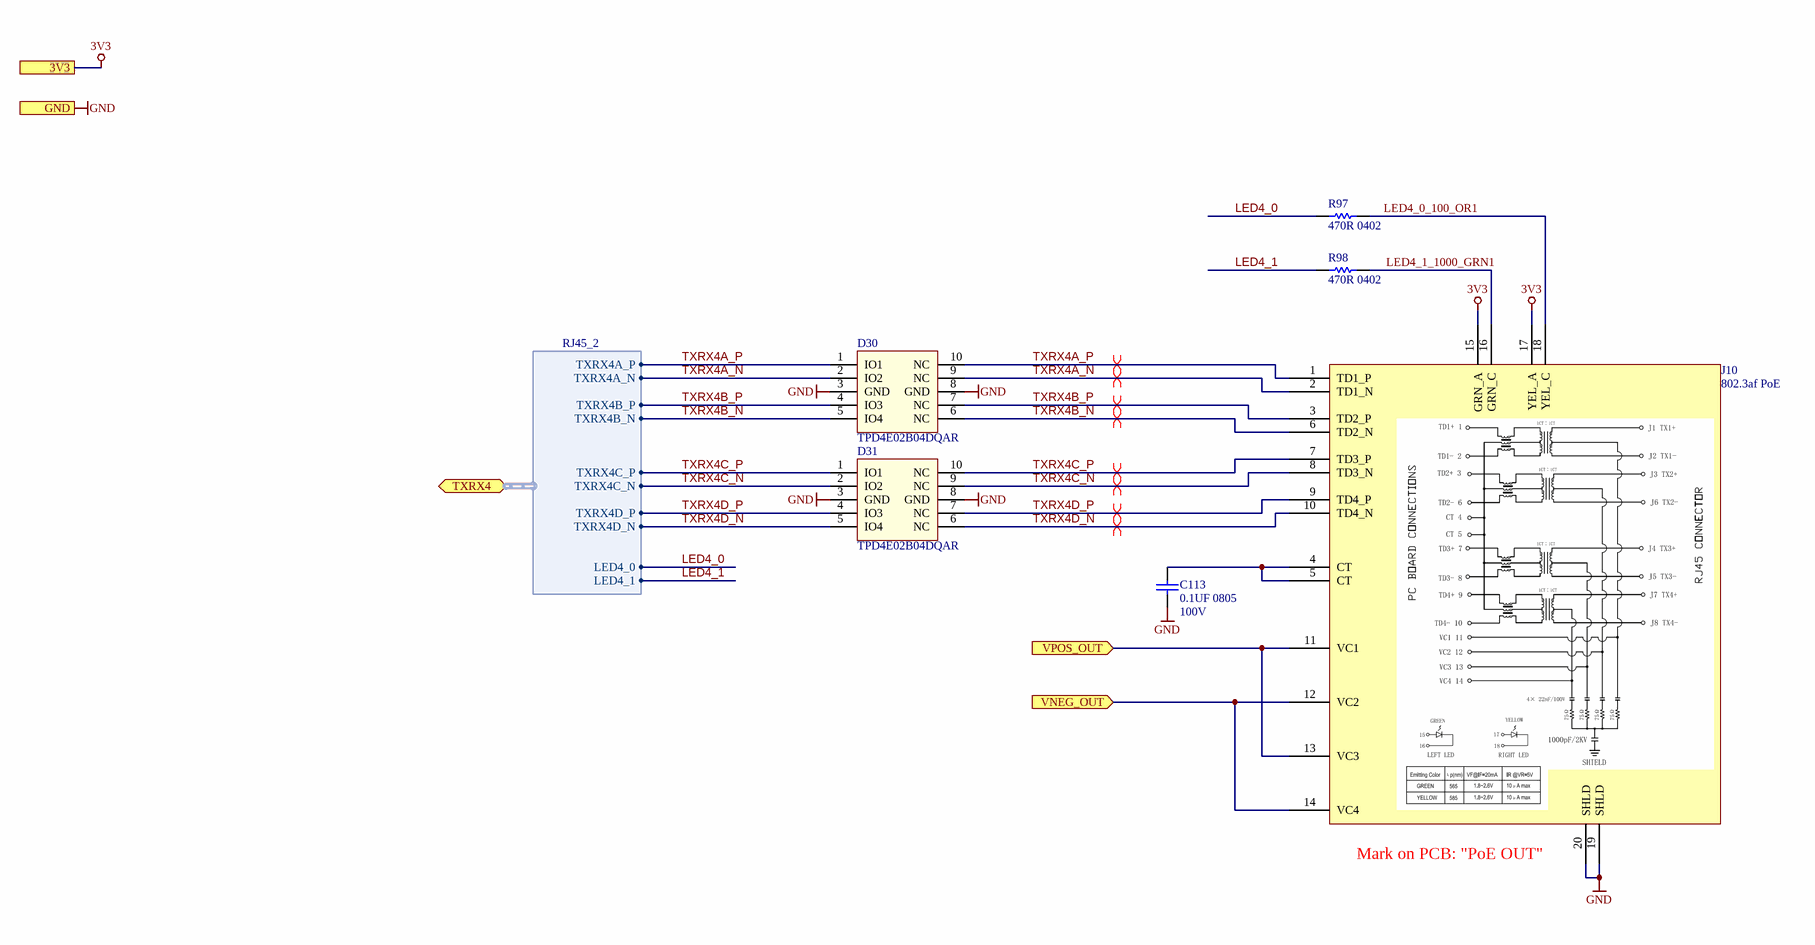
[diagram p11: RJ45_2.SchDoc]

### Parts
C113  0.1UF 0805  Voltage Rating: 100V  [CAPC0805(2012)145_N]
D30  TPD4E02B04DQAR  [TPD4E02B04DQAR]
D31  TPD4E02B04DQAR  [TPD4E02B04DQAR]
J10  802.3af PoE  [TRJG0926HENL]
R97  470R 0402  [RESC0402(1005)_N]
R98  470R 0402  [RESC0402(1005)_N]

### Ports
3V3, GND, TXRX4 (bidir, harness RJ45_2), VNEG_OUT (in), VPOS_OUT (in)

### Harnesses
RJ45_2: TXRX4A_P, TXRX4A_N, TXRX4B_P, TXRX4B_N, TXRX4C_P, TXRX4C_N, TXRX4D_P, TXRX4D_N, LED4_0, LED4_1

### Nets
3V3: J10.15(GRN_A) J10.17(YEL_A) ; port 3V3
GND: C113.1 D30.3(GND) D30.8(GND) D31.3(GND) D31.8(GND) J10.19(SHLD) J10.20(SHLD) ; port GND
LED4_0: R97.1 ; port TXRX4.LED4_0
LED4_0_100_OR1: J10.18(YEL_C) R97.2
LED4_1: R98.1 ; port TXRX4.LED4_1
LED4_1_1000_GRN1: J10.16(GRN_C) R98.2
TXRX4A_N: D30.2(IO2) D30.9(NC) J10.2(TD1_N) ; port TXRX4.TXRX4A_N
TXRX4A_P: D30.1(IO1) D30.10(NC) J10.1(TD1_P) ; port TXRX4.TXRX4A_P
TXRX4B_N: D30.5(IO4) D30.6(NC) J10.6(TD2_N) ; port TXRX4.TXRX4B_N
TXRX4B_P: D30.4(IO3) D30.7(NC) J10.3(TD2_P) ; port TXRX4.TXRX4B_P
TXRX4C_N: D31.2(IO2) D31.9(NC) J10.8(TD3_N) ; port TXRX4.TXRX4C_N
TXRX4C_P: D31.1(IO1) D31.10(NC) J10.7(TD3_P) ; port TXRX4.TXRX4C_P
TXRX4D_N: D31.5(IO4) D31.6(NC) J10.10(TD4_N) ; port TXRX4.TXRX4D_N
TXRX4D_P: D31.4(IO3) D31.7(NC) J10.9(TD4_P) ; port TXRX4.TXRX4D_P
VNEG_OUT: J10.12(VC2) J10.14(VC4) ; port VNEG_OUT
VPOS_OUT: J10.11(VC1) J10.13(VC3) ; port VPOS_OUT
NetC113_2: C113.2 J10.4(CT) J10.5(CT)

### Layout directives
differential pair; net class ETH; differential pair class 100ohm: TXRX4A_N, TXRX4A_P, TXRX4B_N, TXRX4B_P, TXRX4C_N, TXRX4C_P, TXRX4D_N, TXRX4D_P

### Notes on the sheet
- (near J10) Mark on PCB: "PoE OUT"
- Title
- Size:
- Date:
- Tabloid
- Number:
- Time:
- Revision:
- Sheet
- of
- Drawn by:

### Library data of the parts
C113 = CL21B104KCFNNNE: as C50 on sheet RJ45_1; Supplier 1: Digi-Key; Manufacturer Part Number 1: CL21B104KCFNNNE; Stock 1: 93036; Pricing 1: 1=0.10000, 10=0.06800, 100=0.03050, 500=0.02180, 1000=0.01712 (USD); RoHS: Yes; Mount: Surface Mount; Case/Package: 0805; Case Code (Metric): 2012; Case Code (Imperial): 0805; Min Operating Temperature: -55°C; Max Operating Temperature: 125°C; Packaging: Tape and Reel; Dielectric: X7R; Length: 2mm; Width: 0.049inch; Thickness: 0.053inch; Depth: 1.25mm; Radiation Hardening: No; ComponentLink1URL: https://datasheet.ciiva.com/26936/getdatasheetpartid-781823-26936904.pdf?src-supplier=Verical; ComponentLink1Description: https://datasheet.ciiva.com/26936/getdatasheetpartid-781823-26936904.pdf?src-supplier=Verical; Supplier 2: Newark; Supplier 3: Future Electronics; Supplier Part Number 3: CL21B104KCFNNNE-CUTT; Supplier Part Number 2: 82AC9430; Supplier Part Number 1: 1276-6840-1-ND
D30 D31 = TPD4E02B04DQAR: as D17 on sheet RJ45_1; Supplier 1: Digi-Key; Manufacturer Part Number 1: TPD4E02B04DQAR; Stock 1: 25615; Pricing 1: 1=0.69000, 10=0.60800, 100=0.46650, 500=0.36874, 1000=0.29499 (USD); RoHS: Yes; Mount: Surface Mount; Number of Pins: 10; Min Operating Temperature: -40°C; Max Operating Temperature: 125°C; Packaging: Cut Tape; Reverse Standoff Voltage: 3.6V; Clamping Voltage: 8.8V; Operating Supply Voltage: 3.6V; Peak Pulse Current: 5A; Number of Channels: 4; Composition: Zener; REACH SVHC: No SVHC; Lead Free: Lead Free; ComponentLink1URL: http://www.ti.com/general/docs/lit/getliterature.tsp?genericPartNumber=TPD4E02B04&amp;&amp;fileType=pdf&src-supplier=Element14; ComponentLink1Description: http://www.ti.com/general/docs/lit/getliterature.tsp?genericPartNumber=TPD4E02B04&amp;&amp;fileType=pdf&src-supplier=Element14; ComponentLink2URL: http://www.ti.com/lit/ds/symlink/tpd4e02b04.pdf?src-supplier=Farnell; ComponentLink2Description: http://www.ti.com/lit/ds/symlink/tpd4e02b04.pdf?src-supplier=Farnell; ComponentLink3URL: http://www.ti.com/lit/ds/symlink/tpd4e02b04.pdf?src-supplier=Newark; ComponentLink3Description: http://www.ti.com/lit/ds/symlink/tpd4e02b04.pdf?src-supplier=Newark; ComponentLink4URL: http://www.ti.com/lit/ds/symlink/tpd4e02b04.pdf?src-supplier=Digi-Key; ComponentLink4Description: http://www.ti.com/lit/ds/symlink/tpd4e02b04.pdf?src-supplier=Digi-Key; Supplier Part Number 1: 296-43875-1-ND
J10 = TRJG0926HENL: as J1 on sheet RJ45_1; Manufacturer Part Number 1: TRJG0926HENL; Supplier 1: Trxcom; Supplier Part Number 1: TRJG0926HENL
R97 R98 = CRCW0402470RFKED: as R58 on sheet RJ45_1; Supplier 1: Digi-Key; Manufacturer Part Number 1: CRCW0402470RFKED; Stock 1: 9199; Pricing 1: 1=0.10000, 10=0.03800, 100=0.01540, 1000=0.00690, 2500=0.00599, 5000=0.00495 (USD); RoHS: Yes; Case/Package: 0402; Weight: 2.3E-05oz; Case Code (Imperial): 0402; Case Code (Metric): 1005; Min Operating Temperature: -55°C; Max Operating Temperature: 155°C; Packaging: Tape and Reel; Resistance: 470R; Tolerance: 1%; Composition: Thick Film; Voltage Rating (DC): 50V; Termination: SMD/SMT; Military Standard: Not; Length: 1mm; Height: 0.35mm; Width: 0.5mm; Depth: 0.5mm; Lead Free: Lead Free; ComponentLink1URL: https://datasheet.ciiva.com/11811/0900766b80d98824-11811416.pdf?src-supplier=RSComponents; ComponentLink1Description: https://datasheet.ciiva.com/11811/0900766b80d98824-11811416.pdf?src-supplier=RSComponents; Supplier 2: Newark; Supplier Part Number 1: 541-470LCT-ND; Supplier Part Number 2: 26W9133; Mount: Surface Mount; Contact Plating: Tin; Number of Terminations: 2; Package Quantity: 10; Max Power Dissipation: 63mW; Features: Automotive AEC-Q200; Radiation Hardening: No; REACH SVHC: Unknown; ComponentLink2URL: https://datasheet.ciiva.com/16764/70201119-16764886.pdf?src-supplier=Allied+Electronics; ComponentLink2Description: https://datasheet.ciiva.com/16764/70201119-16764886.pdf?src-supplier=Allied+Electronics; ComponentLink3URL: https://datasheet.ciiva.com/28613/1720486-28613479.pdf?src-supplier=Element14; ComponentLink3Description: https://datasheet.ciiva.com/28613/1720486-28613479.pdf?src-supplier=Element14; ComponentLink4URL: https://datasheet.ciiva.com/3256/dcrcwe3-3256553.pdf?src-supplier=Avnet; ComponentLink4Description: https://datasheet.ciiva.com/3256/dcrcwe3-3256553.pdf?src-supplier=Avnet; ComponentLink5URL: https://datasheet.ciiva.com/7777/1720486-7777243.pdf?src-supplier=Element14; ComponentLink5Description: https://datasheet.ciiva.com/7777/1720486-7777243.pdf?src-supplier=Element14; ComponentLink6URL: https://datasheet.ciiva.com/8336/dcrcwe3-8336715.pdf?src-supplier=Avnet; ComponentLink6Description: https://datasheet.ciiva.com/8336/dcrcwe3-8336715.pdf?src-supplier=Avnet; ComponentLink7URL: https://datasheet.ciiva.com/7777/1697337-7777244.pdf?src-supplier=Element14; ComponentLink7Description: https://datasheet.ciiva.com/7777/1697337-7777244.pdf?src-supplier=Element14; ComponentLink8URL: https://datasheet.ciiva.com/2463/dcrcwe3-2463085.pdf?src-supplier=Digi-Key; ComponentLink8Description: https://datasheet.ciiva.com/2463/dcrcwe3-2463085.pdf?src-supplier=Digi-Key; ComponentLink9URL: https://datasheet.ciiva.com/16362/dcrcwe3-16362109.pdf?src-supplier=Future+Electronics; ComponentLink9Description: https://datasheet.ciiva.com/16362/dcrcwe3-16362109.pdf?src-supplier=Future+Electronics; ComponentLink10URL: https://datasheet.ciiva.com/16882/dcrcwe3-16882493.pdf?src-supplier=Avnet+Europe; ComponentLink10Description: https://datasheet.ciiva.com/16882/dcrcwe3-16882493.pdf?src-supplier=Avnet+Europe; ComponentLink11URL: https://datasheet.ciiva.com/2463/dcrcwe3-2463086.pdf?src-supplier=Digi-Key; ComponentLink11Description: https://datasheet.ciiva.com/2463/dcrcwe3-2463086.pdf?src-supplier=Digi-Key; ComponentLink12URL: https://datasheet.ciiva.com/2463/dcrcwe3-2463087.pdf?src-supplier=Digi-Key; ComponentLink12Description: https://datasheet.ciiva.com/2463/dcrcwe3-2463087.pdf?src-supplier=Digi-Key